# EAGLE schematic ADC_DSP (EAGLE 7.1.0)
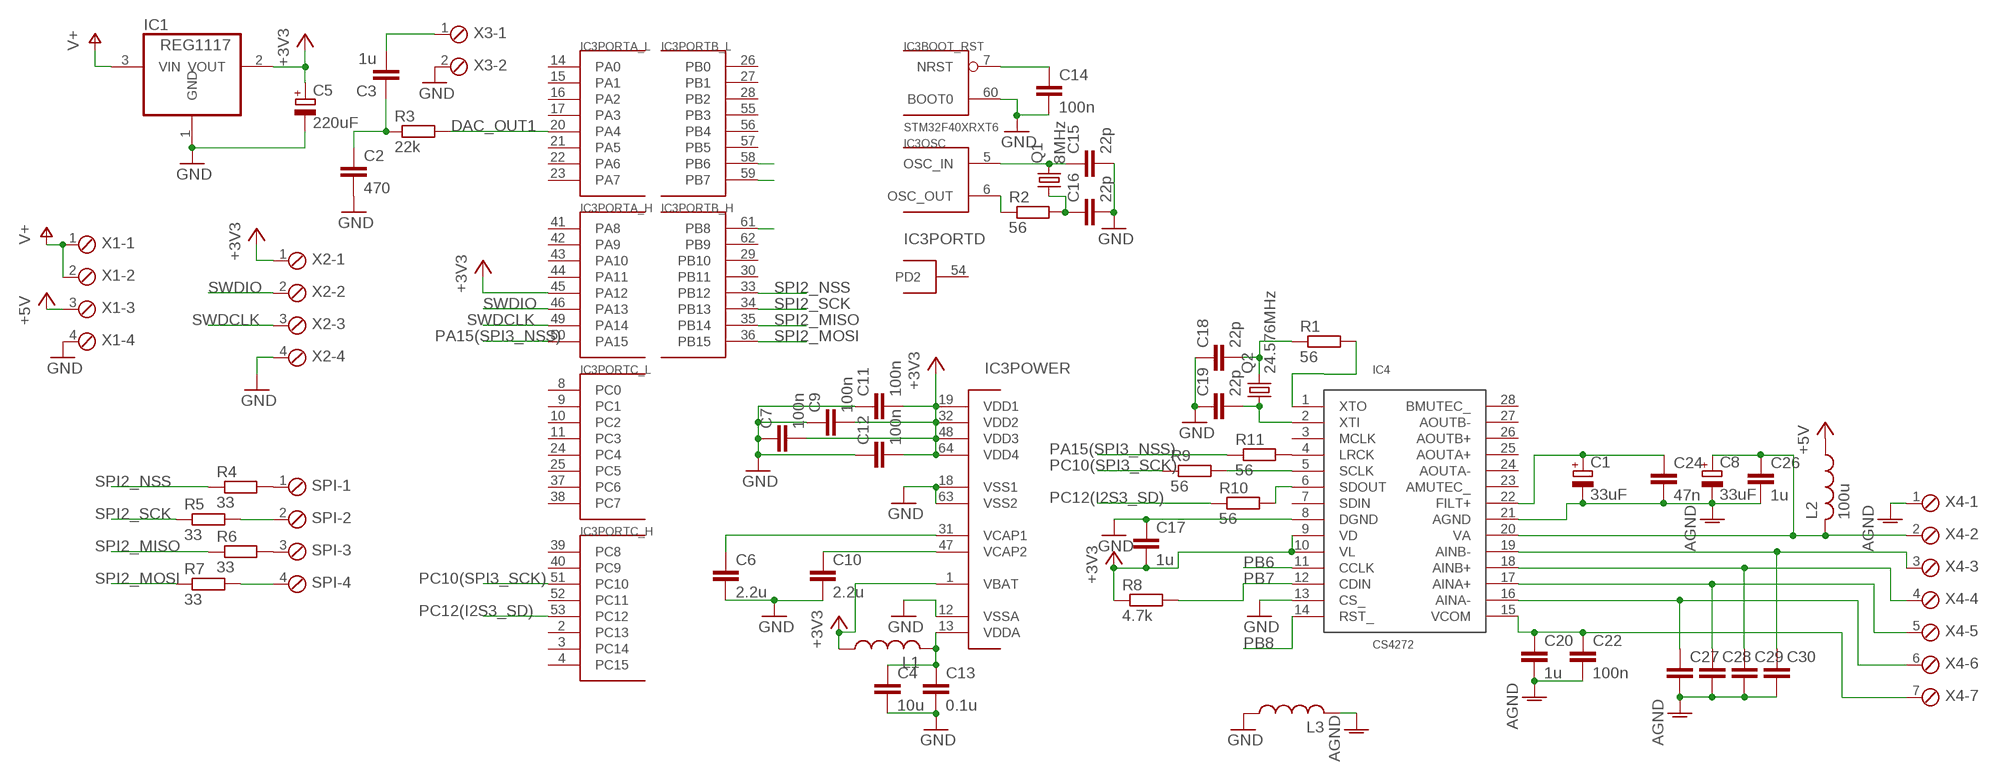
[diagram p0: schematic, sheet 1]

## Parts
C1  33uF  CPOL-EU153CLV-0605  [153CLV-0605]
C2  470  C-EUC0603  [C0603]
C3  1u  C-EUC0603  [C0603]
C4  10u  C-EUC0805  [C0805]
C5  220uF  CPOL-EU153CLV-0605  [153CLV-0605]
C6  2.2u  C-EUC0603  [C0603]
C7  100n  C-EUC0603  [C0603]
C8  33uF  CPOL-EU153CLV-0605  [153CLV-0605]
C9  100n  C-EUC0603  [C0603]
C10  2.2u  C-EUC0603  [C0603]
C11  100n  C-EUC0603  [C0603]
C12  100n  C-EUC0603  [C0603]
C13  0.1u  C-EUC0603  [C0603]
C14  100n  C-EUC0603  [C0603]
C15  22p  C-EUC0603  [C0603]
C16  22p  C-EUC0603  [C0603]
C17  1u  C-EUC0603  [C0603]
C18  22p  C-EUC0603  [C0603]
C19  22p  C-EUC0603  [C0603]
C20  1u  C-EUC0603  [C0603]
C22  100n  C-EUC0603  [C0603]
C24  47n  C-EUC0805  [C0805]
C26  1u  C-EUC0603  [C0603]
C27  C-EUC0805  [C0805]
C28  C-EUC0805  [C0805]
C29  C-EUC0805  [C0805]
C30  C-EUC0805  [C0805]
IC1  REG1117  [SOT223]
IC3  STM32F40XRXT6  [TQFP64]
IC4  CS4272  [TSSOP28]
L1  L-USL2012C  [L2012C]
L2  100u  L-US0207/12  [0207/12]
L3  L-USL2012C  [L2012C]
Q1  8MHz  CRYSTALHC49S  [HC49/S]
Q2  24.576MHz  CRYSTALHC49S  [HC49/S]
R1  56  R-EU_R0603  [R0603]
R2  56  R-EU_R0603  [R0603]
R3  22k  R-EU_R0603  [R0603]
R4  33  R-EU_R0603  [R0603]
R5  33  R-EU_R0603  [R0603]
R6  33  R-EU_R0603  [R0603]
R7  33  R-EU_R0603  [R0603]
R8  4.7k  R-EU_R0603  [R0603]
R9  56  R-EU_R0603  [R0603]
R10  56  R-EU_R0603  [R0603]
R11  56  R-EU_R0603  [R0603]
SPI  MPT4  [4POL254]
X1  MPT4  [4POL254]
X2  MPT4  [4POL254]
X3  MPT2  [2POL254]
X4  MPT7  [7POL254]

## Nets
+3V3: C5.+ C7.2 C9.2 C11.2 C12.2 C17.2 IC1.2(VOUT) IC3.1(POWER:VBAT) IC3.19(POWER:VDD1) IC3.32(POWER:VDD2) IC3.45(PORTA_H:PA12) IC3.48(POWER:VDD3) IC3.64(POWER:VDD4) IC4.9(VD) IC4.10(VL) L1.1 R8.1 X2.1
+5V: L2.1 X1.3
AGND: C1.- C8.- C20.2 C22.2 C24.2 C26.2 C27.2 C28.2 C29.2 C30.2 IC4.21(AGND) L3.2 X4.1
AINA+: C28.1 IC4.17(AINA+) X4.5
AINB+: C29.1 IC4.18(AINB+) X4.4
AVCC: C8.+ C26.1 IC4.20(VA) L2.2 X4.2
DAC_OUT1: IC3.20(PORTA_L:PA4) R3.2
GND: C2.2 C4.2 C5.- C6.2 C7.1 C9.1 C10.2 C11.1 C12.1 C13.2 C14.2 C15.2 C16.2 C17.1 C18.1 C19.1 IC1.1(GND) IC3.12(POWER:VSSA) IC3.18(POWER:VSS1) IC3.60(BOOT_RST:BOOT0) IC3.63(POWER:VSS2) IC4.8(DGND) IC4.13(CS_) L3.1 X1.4 X2.4 X3.2
N$1: C10.1 IC3.47(POWER:VCAP2)
N$2: C6.1 IC3.31(POWER:VCAP1)
N$3: C4.1 C13.1 IC3.13(POWER:VDDA) L1.2
N$4: C14.1 IC3.7(BOOT_RST:NRST)
N$5: C15.1 IC3.5(OSC:OSC_IN) Q1.2
N$6: C16.1 Q1.1 R2.2
N$7: C19.2 IC4.2(XTI) Q2.1
N$8: C18.2 Q2.2 R1.1
N$9: IC4.4(LRCK) R11.2
N$10: IC4.5(SCLK) R9.2
N$11: IC4.6(SDOUT) R10.2
N$12: C1.+ C24.1 IC4.22(FILT+)
N$15: C30.1 IC4.19(AINB-) X4.3
N$16: C3.2 X3.1
N$17: IC4.1(XTO) R1.2
N$18: C27.1 IC4.16(AINA-) X4.6
N$19: IC3.6(OSC:OSC_OUT) R2.1
N$20: R4.2 SPI.1
N$21: R5.2 SPI.2
N$22: R6.2 SPI.3
N$23: C2.1 C3.1 R3.1
N$24: R7.2 SPI.4
PA15(SPI3_NSS): IC3.50(PORTA_H:PA15) R11.1
PB6: IC3.58(PORTB_L:PB6) IC4.11(CCLK)
PB7: IC3.59(PORTB_L:PB7) IC4.12(CDIN) R8.2
PB8: IC3.61(PORTB_H:PB8) IC4.14(RST_)
PC10(SPI3_SCK): IC3.51(PORTC_H:PC10) R9.1
PC12(I2S3_SD): IC3.53(PORTC_H:PC12) R10.1
SPI2_MISO: IC3.35(PORTB_H:PB14) R6.1
SPI2_MOSI: IC3.36(PORTB_H:PB15) R7.1
SPI2_NSS: IC3.33(PORTB_H:PB12) R4.1
SPI2_SCK: IC3.34(PORTB_H:PB13) R5.1
SWDCLK: IC3.49(PORTA_H:PA14) X2.3
SWDIO: IC3.46(PORTA_H:PA13) X2.2
V+: IC1.3(VIN) X1.1 X1.2
VCOM: C20.1 C22.1 IC4.15(VCOM) X4.7
Unconnected: IC3.2(PORTC_H:PC13) IC3.3(PORTC_H:PC14) IC3.4(PORTC_H:PC15) IC3.8(PORTC_L:PC0) IC3.9(PORTC_L:PC1) IC3.10(PORTC_L:PC2) IC3.11(PORTC_L:PC3) IC3.14(PORTA_L:PA0) IC3.15(PORTA_L:PA1) IC3.16(PORTA_L:PA2) IC3.17(PORTA_L:PA3) IC3.21(PORTA_L:PA5) IC3.22(PORTA_L:PA6) IC3.23(PORTA_L:PA7) IC3.24(PORTC_L:PC4) IC3.25(PORTC_L:PC5) IC3.26(PORTB_L:PB0) IC3.27(PORTB_L:PB1) IC3.28(PORTB_L:PB2) IC3.29(PORTB_H:PB10) IC3.30(PORTB_H:PB11) IC3.37(PORTC_L:PC6) IC3.38(PORTC_L:PC7) IC3.39(PORTC_H:PC8) IC3.40(PORTC_H:PC9) IC3.41(PORTA_H:PA8) IC3.42(PORTA_H:PA9) IC3.43(PORTA_H:PA10) IC3.44(PORTA_H:PA11) IC3.52(PORTC_H:PC11) IC3.54(PORTD:PD2) IC3.55(PORTB_L:PB3) IC3.56(PORTB_L:PB4) IC3.57(PORTB_L:PB5) IC3.62(PORTB_H:PB9) IC4.3(MCLK) IC4.7(SDIN) IC4.23(AMUTEC_) IC4.24(AOUTA-) IC4.25(AOUTA+) IC4.26(AOUTB+) IC4.27(AOUTB-) IC4.28(BMUTEC_)

## Library data of the parts
C1 C5 C8 = rcl:CPOL-EU: POLARIZED CAPACITOR, European symbol
C2-C4 C6 C7 C9-C20 C22 C24 C26-C30 = rcl:C-EU: CAPACITOR, European symbol
IC1 = burr-brown:REG1117: 800mA and 1A Low Dropout (LDO) Positive Regulator 1.8V, 2.5V, 2.85V, 3.3V, 5V, and Adj; MPN: REG1117; OC_FARNELL: 1097566; OC_NEWARK: 14P6981
IC3 = stm32:STM32F40XRXT6: STM32F40X LQFP64
IC4 = balmer:CS4272: 24-Bit, 192 kHz Stereo Audio CODEC
L1-L3 = rcl:L-US: INDUCTOR, American symbol
Q1 Q2 = crystal:CRYSTAL: CRYSTAL; OC_FARNELL: 1667008; OC_NEWARK: unknown
R1-R11 = rcl:R-EU_: RESISTOR, European symbol
SPI X1 X2 = con-phoenix-254:MPT4: PHOENIX CONNECTOR; OC_FARNELL: unknown; OC_NEWARK: unknown
X3 = con-phoenix-254:MPT2: PHOENIX CONNECTOR; OC_FARNELL: unknown; OC_NEWARK: unknown
X4 = con-phoenix-254:MPT7: PHOENIX CONNECTOR; OC_FARNELL: unknown; OC_NEWARK: unknown